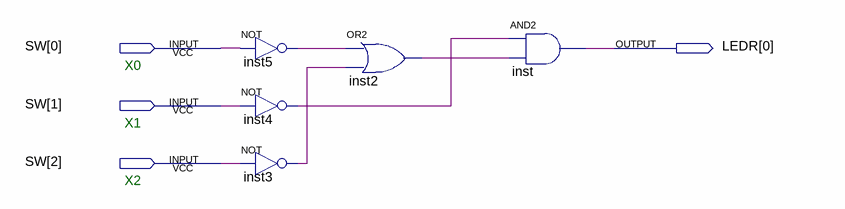
[diagram p0: schematic sheet]
// Quartus schematic projeto1.bdf as structural Verilog: 5 symbols, 4 pins
module projeto1 (
  input  [2:0] SW,
  output [0:0] LEDR
);

  wire inst2_out, inst3_out, inst4_out, inst5_out;

  not inst5 (inst5_out, SW[0]);
  not inst4 (inst4_out, SW[1]);
  not inst3 (inst3_out, SW[2]);
  or inst2 (inst2_out, inst5_out, inst3_out);
  and inst (LEDR[0], inst4_out, inst2_out);

  // Notes on the sheet:
  //   X0
  //   X1
  //   X2
endmodule
